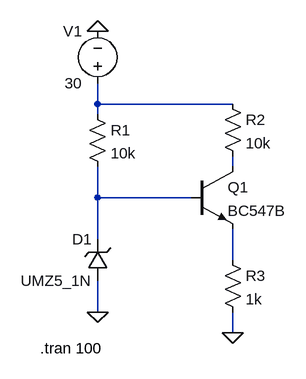
[diagram p0: schematic Zener diode voltage regulator -emitter follower-.asc]
Zener diode voltage regulator -emitter follower-.asc, the LTspice schematic file:
Version 4
SHEET 1 880 680
WIRE 112 128 112 96
WIRE 320 128 112 128
WIRE 112 144 112 128
WIRE 320 224 320 208
WIRE 112 272 112 224
WIRE 256 272 112 272
WIRE 112 336 112 272
WIRE 320 368 320 320
WIRE 112 448 112 400
WIRE 320 480 320 448
FLAG 112 448 0
FLAG 320 480 0
FLAG 112 16 0
SYMBOL voltage 112 112 R180
WINDOW 0 24 96 Left 2
WINDOW 3 24 16 Left 2
WINDOW 123 0 0 Left 0
WINDOW 39 0 0 Left 0
SYMATTR InstName V1
SYMATTR Value 30
SYMBOL res 96 128 R0
SYMATTR InstName R1
SYMATTR Value 10k
SYMBOL npn 256 224 R0
SYMATTR InstName Q1
SYMATTR Value BC547B
SYMBOL res 304 352 R0
SYMATTR InstName R3
SYMATTR Value 1k
SYMBOL res 304 112 R0
SYMATTR InstName R2
SYMATTR Value 10k
SYMBOL zener 128 400 R180
WINDOW 0 24 64 Left 2
WINDOW 3 24 0 Left 2
SYMATTR InstName D1
SYMATTR Value UMZ5_1N
SYMATTR Description Diode
SYMATTR Type diode
TEXT 24 504 Left 2 !.tran 100

The netlist it stands for:
* Zener diode voltage regulator -emitter follower-.asc
V1 N001 0 30
R1 N001 N003 10k
Q1 N002 N003 N004 0 BC547B
R3 N004 0 1k
R2 N001 N002 10k
D1 0 N003 UMZ5_1N
.model D D
.lib standard.dio
.model NPN NPN
.model PNP PNP
.lib standard.bjt
.tran 100
.backanno
.end